# EAGLE design NAND_FLASH_TESTBENCH (EAGLE 9.6.2)
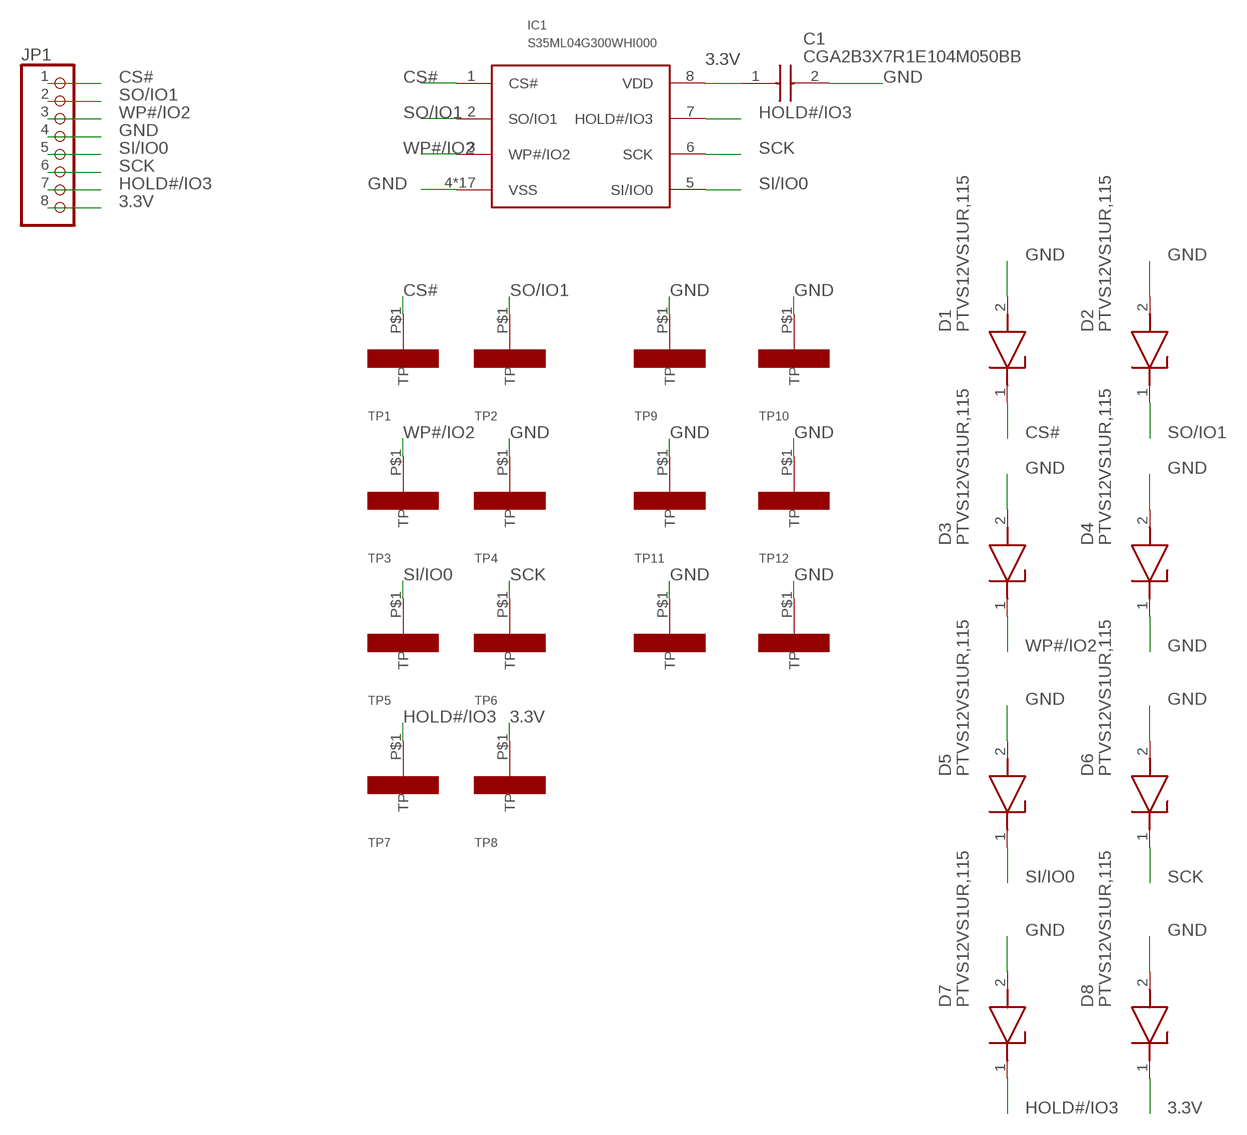
[diagram p0: schematic, sheet 1]

## Parts
C1  CGA2B3X7R1E104M050BB  [CAPC1005X55N]
D1  PTVS12VS1UR,115  [SOD123W]
D2  PTVS12VS1UR,115  [SOD123W]
D3  PTVS12VS1UR,115  [SOD123W]
D4  PTVS12VS1UR,115  [SOD123W]
D5  PTVS12VS1UR,115  [SOD123W]
D6  PTVS12VS1UR,115  [SOD123W]
D7  PTVS12VS1UR,115  [SOD123W]
D8  PTVS12VS1UR,115  [SOD123W]
IC1  S35ML04G300WHI000  [S35ML04G300WHI000]
JP1  PINHD-1X8  [1X08]
TP1  S1751-46R  [1.85X3.45_MM]
TP2  S1751-46R  [1.85X3.45_MM]
TP3  S1751-46R  [1.85X3.45_MM]
TP4  S1751-46R  [1.85X3.45_MM]
TP5  S1751-46R  [1.85X3.45_MM]
TP6  S1751-46R  [1.85X3.45_MM]
TP7  S1751-46R  [1.85X3.45_MM]
TP8  S1751-46R  [1.85X3.45_MM]
TP9  S1751-46R  [1.85X3.45_MM]
TP10  S1751-46R  [1.85X3.45_MM]
TP11  S1751-46R  [1.85X3.45_MM]
TP12  S1751-46R  [1.85X3.45_MM]
TP13  S1751-46R  [1.85X3.45_MM]
TP14  S1751-46R  [1.85X3.45_MM]

## Nets
3.3V: C1.1 D8.1(K) IC1.8(VDD) JP1.8 TP8.P$1(TP)
CS#: D1.1(K) IC1.1(CS#) JP1.1 TP1.P$1(TP)
GND: C1.2 D1.2(A) D2.2(A) D3.2(A) D4.1(K) D4.2(A) D5.2(A) D6.2(A) D7.2(A) D8.2(A) IC1.4(VSS) IC1.P$1(VSS) IC1.P$2(VSS) IC1.P$3(VSS) IC1.P$4(VSS) IC1.P$5(VSS) IC1.P$6(VSS) IC1.P$7(VSS) IC1.P$8(VSS) IC1.P$9(VSS) IC1.P$10(VSS) IC1.P$11(VSS) IC1.P$12(VSS) IC1.P$13(VSS) IC1.P$14(VSS) IC1.P$15(VSS) IC1.P$16(VSS) JP1.4 TP4.P$1(TP) TP9.P$1(TP) TP10.P$1(TP) TP11.P$1(TP) TP12.P$1(TP) TP13.P$1(TP) TP14.P$1(TP)
HOLD#/IO3: D7.1(K) IC1.7(HOLD#/IO3) JP1.7 TP7.P$1(TP)
SCK: D6.1(K) IC1.6(SCK) JP1.6 TP6.P$1(TP)
SI/IO0: D5.1(K) IC1.5(SI/IO0) JP1.5 TP5.P$1(TP)
SO/IO1: D2.1(K) IC1.2(SO/IO1) JP1.2 TP2.P$1(TP)
WP#/IO2: D3.1(K) IC1.3(WP#/IO2) JP1.3 TP3.P$1(TP)

## Library data of the parts
C1 = SamacSys_Parts:CGA2B3X7R1E104M050BB: Multilayer Ceramic Capacitors MLCC - SMD/SMT CGA 0402 25V 0.1uF X7R 20% AEC-Q200 Source: Datasheet <https://componentsearchengine.com/Datasheets/1/CGA2B3X7R1E104M050BB.pdf>; DESCRIPTION: Multilayer Ceramic Capacitors MLCC - SMD/SMT CGA 0402 25V 0.1uF X7R 20% AEC-Q200; HEIGHT: 0.55mm; MANUFACTURER_NAME: TDK; MANUFACTURER_PART_NUMBER: CGA2B3X7R1E104M050BB; MOUSER_PART_NUMBER: 810-CGA2B3X7R1E104MB; MOUSER_PRICE-STOCK: https://www.mouser.com/Search/Refine.aspx?Keyword=810-CGA2B3X7R1E104MB
D1-D8 = SamacSys_Parts:PTVS12VS1UR,115: PTVSxS1UR series - 400 W Transient Voltage Suppressor Source: Datasheet <https://assets.nexperia.com/documents/data-sheet/PTVSXS1UR_SER.pdf>; DESCRIPTION: PTVSxS1UR series - 400 W Transient Voltage Suppressor; HEIGHT: mm; MANUFACTURER_NAME: Nexperia; MANUFACTURER_PART_NUMBER: PTVS12VS1UR,115; MOUSER_PART_NUMBER: 771-PTVS12VS1UR115; MOUSER_PRICE-STOCK: https://www.mouser.co.uk/ProductDetail/Nexperia/PTVS12VS1UR115?qs=LMSg3oBIm%2FiWSHvsyxWiLg%3D%3D
IC1 = SamacSys_Parts:S35ML04G300WHI000; DESCRIPTION: NAND Flash SLC,4Gb,16nm,3.3V,4GB,LGA8; MANUFACTURER_NAME: SkyHigh Memory; MANUFACTURE_PART_NUMBER: S35ML04G300WHI000; MOUSER_LINK: https://www.mouser.com/ProductDetail/SkyHigh-Memory/S35ML04G300WHI000?qs=A6eO%252BMLsxmShmFPg7lOG0w%3D%3D
JP1 = pinhead:PINHD-1X8: PIN HEADER
TP1-TP14 = SamacSys_Parts:S1751-46R

## Board
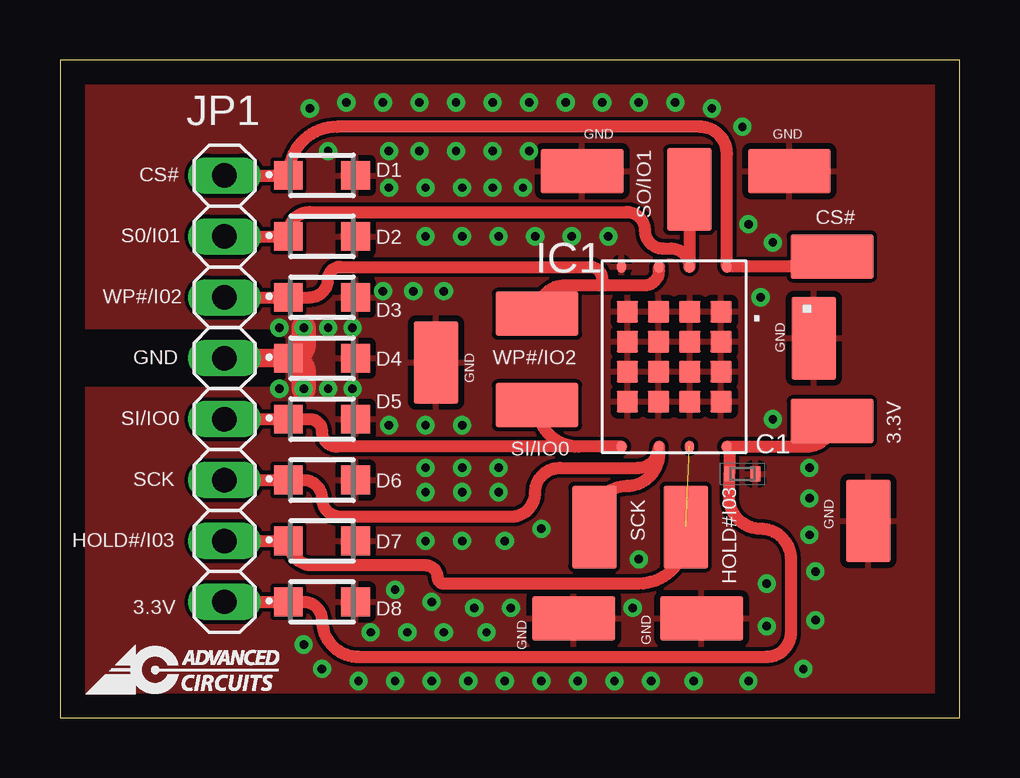
[diagram p1: board, top side]
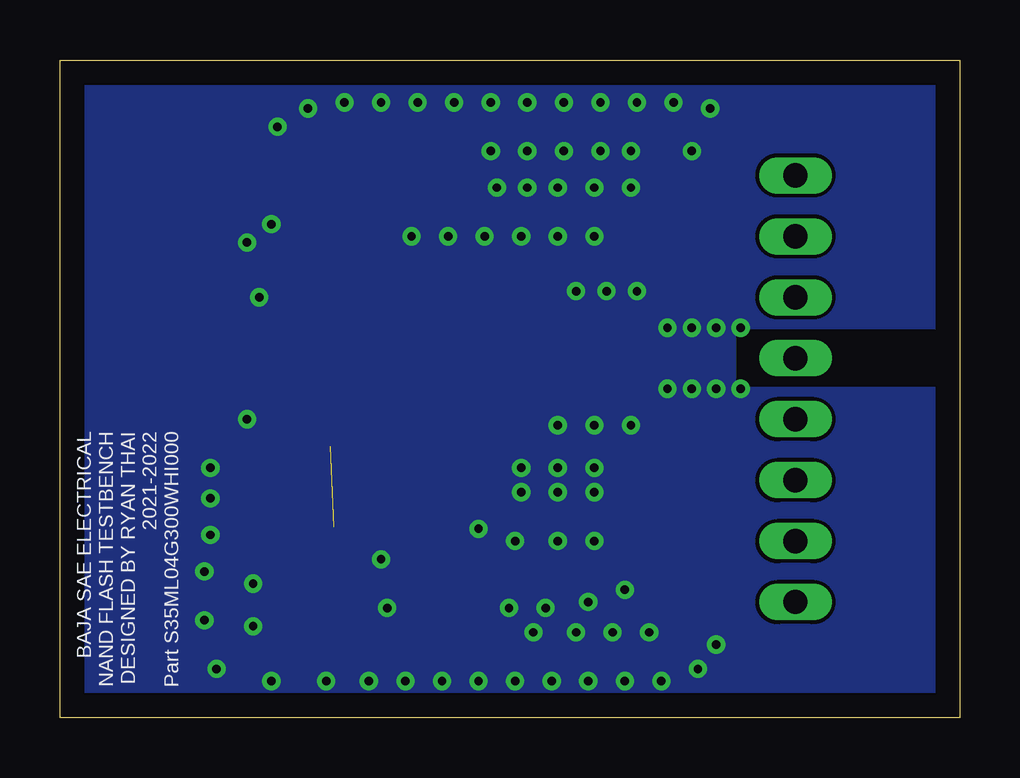
[diagram p2: board, bottom side, seen from below]

Size 37.52 x 27.42 mm. Coordinates in mm from the lower left corner, seen from the top.
Outline: 0,0 37.52,0 37.52,27.42 0,27.42 0,0
Copper layers (1*16): Top 0.035mm / dielectric 1.5mm / Bottom 0.035mm
Design rules "default *": minimum track width 6mil, minimum drill 0.35mm, track to track 6mil, track to pad 6mil, pad to pad 6mil, via to via 6mil, smd to smd 6mil, copper to edge 40mil, drill to drill 6mil, minimum pad ring 10mil, minimum via ring 8mil, stop-mask expansion 4mil, vias tented up to drill 20mil, thermal gap 10mil

### Footprints (pad centres in the part's own frame; a part is rotated, then mirrored left to right if it is on the bottom)
CAPC1005X55N = smd 0.42 x 0.62: 1 -0.55,0; 2 0.55,0
SOD123W = smd 1.2 x 1.2: 1 -1.4,0; 2 1.4,0
S35ML04G300WHI000 = smd 0.5 x 0.4: 1 0.25,5.2; 2 0.25,3.635; 3 0.25,2.365; 4 0.25,0.8; 5 7.75,0.8; 6 7.75,2.365; 7 7.75,3.635; 8 7.75,5.2 | smd 0.9 x 0.9: P$1 2.125,1.05; P$2 3.375,1.05; P$3 4.625,1.05; P$4 5.875,1.05; P$5 2.125,2.35; P$6 2.125,3.65; P$7 2.125,4.95; P$8 3.375,2.35; P$9 3.375,3.65; P$10 3.375,4.95; P$11 4.625,2.35; P$12 4.625,3.65; P$13 4.625,4.95; P$14 5.875,2.35; P$15 5.875,3.65; P$16 5.875,4.95
1X08 = drill 1.016 long: 1 -8.89,0; 2 -6.35,0; 3 -3.81,0; 4 -1.27,0; 5 1.27,0; 6 3.81,0; 7 6.35,0; 8 8.89,0
1.85X3.45_MM = smd 1.85 x 3.45: P$1 -0.94,1.702

### Placement (x,y rotation side)
C1  28.45,10.16 0 top
D1  10.92,22.61 0 top
D2  10.92,20.07 0 top
D3  10.92,17.53 0 top
D4  10.92,14.99 0 top
D5  10.92,12.45 0 top
D6  10.92,9.91 0 top
D7  10.92,7.37 0 top
D8  10.92,4.83 0 top
IC1  22.61,19.05 270 top
JP1  6.86,13.72 270 top
TP1  30.48,18.29 270 top
TP2  27.18,20.32 0 top
TP3  21.59,17.78 90 top
TP4  28.7,21.84 270 top
TP5  21.59,13.97 90 top
TP6  21.34,9.65 180 top
TP7  25.15,9.65 180 top
TP8  30.48,11.43 270 top
TP9  30.48,17.53 180 top
TP10  20.07,21.84 270 top
TP11  32.77,9.91 180 top
TP12  28.45,5.08 90 top
TP13  23.11,5.08 90 top
TP14  14.73,16.51 180 top

### Tracks (layer width: path | path; a pad name or v marks a point on that pad's centre or on a via)
3.3V
  Top 0.508: JP1.8 D8.1 10.16,4.83 arc-90 10.92,4.06 arc90 12.45,2.54 29.46,2.54 arc90 30.48,3.56 30.48,6.6 arc90 29.21,7.87 arc-90 27.9,9.19 C1.1 27.9,11.21 | TP8.P$1 arc-90 31.11,11.3 IC1.8 | 27.9,11.21 arc90 IC1.8 | IC1.8 arc-90 27.9,11.21
CS#
  Top 0.508: JP1.1 D1.1 arc-90 11.55,24.64 26.67,24.64 arc-90 27.81,23.5 IC1.1 31.75,18.8 arc90 TP1.P$1
GND  (via drill 0.35)
  Top 0.762: JP1.4 D4.1
  Top 1.016: v10.16,16.26 10.16,15.62 arc-90 D4.1 arc-90 10.16,14.35 v10.16,13.72
  other vias: 12.19,13.72 11.18,13.72 9.14,13.72 12.19,16.26 11.18,16.26 9.14,16.26 10.41,25.4 11.94,25.65 13.46,25.65 14.99,25.65 16.51,25.65 18.03,25.65 19.56,25.65 21.08,25.65 22.61,25.65 24.13,25.65 25.65,25.65 27.18,25.4 28.45,24.64 13.72,23.62 14.99,23.62 16.51,23.62 18.03,23.62 19.56,23.62 13.72,22.1 15.24,22.1 16.76,22.1 18.03,22.1 19.3,22.1 15.24,20.07 16.76,20.07 18.29,20.07 19.81,20.07 28.7,20.57 29.72,19.81 29.21,17.53 16,17.78 14.73,17.78 13.46,17.78 13.72,12.19 15.24,12.19 16.76,12.19 15.24,10.41 16.76,10.41 18.29,10.41 15.24,9.4 16.76,9.4 18.29,9.4 15.24,7.37 16.76,7.37 18.54,7.37 20.07,7.87 24.13,6.6 31.24,10.41 31.24,9.14 31.24,7.62 29.46,5.59 31.5,6.1 29.46,3.81 31.5,4.06 30.99,2.03 28.7,1.52 26.42,1.52 24.64,1.52 23.11,1.52 21.59,1.52 20.07,1.52 18.54,1.52 17.02,1.52 15.49,1.52 13.97,1.52 12.45,1.52 10.92,2.03 10.16,3.05 12.95,3.56 14.48,3.56 16,3.56 17.78,3.56 18.8,4.57 17.27,4.57 23.88,4.57 15.49,4.83 13.97,5.33 29.72,12.45 21.34,20.07 22.86,20.07 11.18,23.62
  pour Top: 0,27.43 37.59,27.43 37.59,0 0,0 0,13.72 9.4,13.72 9.4,16.26 0,16.26
  pour Bottom: 0,27.43 37.59,27.43 37.59,0 0,0 0,13.72 9.4,13.72 9.4,16.26 0,16.26
HOLD#/IO3  (1 unrouted)
  Top 0.508: JP1.7 D7.1 arc90 10.54,6.35 15.24,6.35 arc-90 15.75,5.84 arc90 16,5.59 24.13,5.59 arc90 26.09,7.54 TP7.P$1
SCK
  Top 0.508: JP1.6 D6.1 10.16,9.91 arc-90 10.92,9.14 arc90 11.68,8.38 18.8,8.38 arc90 19.81,9.4 arc-90 20.83,10.41 24.09,10.41 arc90 IC1.6 24.97,11 arc-90 23.62,9.65 arc90 22.28,8.31 TP6.P$1
SI/IO0
  Top 0.508: JP1.5 D5.1 10.41,12.45 arc-90 10.92,11.94 arc90 11.56,11.3 IC1.5 21.62,11.3 arc-90 TP5.P$1
SO/IO1
  Top 0.508: IC1.2 arc90 IC1.2 | IC1.2 arc90 IC1.2 | IC1.2 arc90 25.48,19.56 25.15,19.56 arc-90 24.38,20.32 arc90 23.62,21.08 10.41,21.08 arc90 9.52,20.19 D2.1 JP1.2 | IC1.2 arc90 IC1.2 | IC1.2 arc90 IC1.2 | TP2.P$1 IC1.2
WP#/IO2
  Top 0.508: JP1.3 D3.1 10.41,17.53 arc90 11.18,18.29 arc-90 11.68,18.8 22.1,18.8 arc-90 22.61,18.29 arc90 22.86,18.03 | 22.86,18.03 24.38,18.03 arc90 24.97,18.62 IC1.3 | TP3.P$1 arc-90 21.08,18.03 22.86,18.03

### Text on the board
tPlace: GND | GND | CS# | SO/IO1 | CS# | S0/I01 | WP#/I02 | . | GND | WP#/IO2 | GND | GND | SI/IO0 | SI/IO0 | 3.3V | SCK | GND | HOLD#/I03 | SCK | HOLD#I03 | 3.3V | GND | GND
bNames: BAJA SAE ELECTRICAL / NAND FLASH TESTBENCH / DESIGNED BY RYAN THAI / 2021-2022 / Part S35ML04G300WHI000